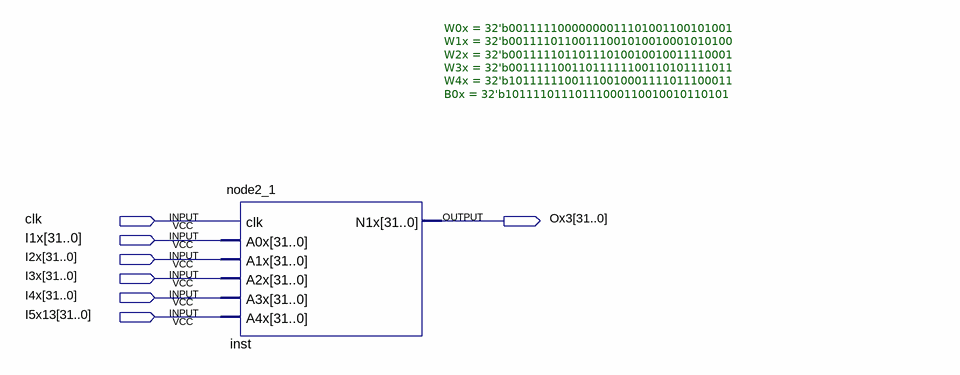
[diagram p0: schematic sheet]
// Quartus schematic Layer_1_test.bdf as structural Verilog: 1 symbols, 7 pins
module Layer_1_test (
  input  clk,
  input  [31:0] I1x,
  input  [31:0] I2x,
  input  [31:0] I3x,
  input  [31:0] I4x,
  input  [31:0] I5x13,
  output [31:0] Ox3
);

  node2_1 #(.W0x(32'b00111110000000011101001100101001), .W1x(32'b00111101100111001010010001010100), .W2x(32'b00111110110111010010010011110001), .W3x(32'b00111110011011111100110101111011), .W4x(32'b10111111001110010001111011100011), .B0x(32'b10111101110111000110010010110101)) inst (
    .clk(clk), .A0x(I1x), .A1x(I2x), .A2x(I3x), .A3x(I4x), .A4x(I5x13), .N1x(Ox3));
endmodule
